# EAGLE schematic example-bjt-circuits (EAGLE 9.6.1)
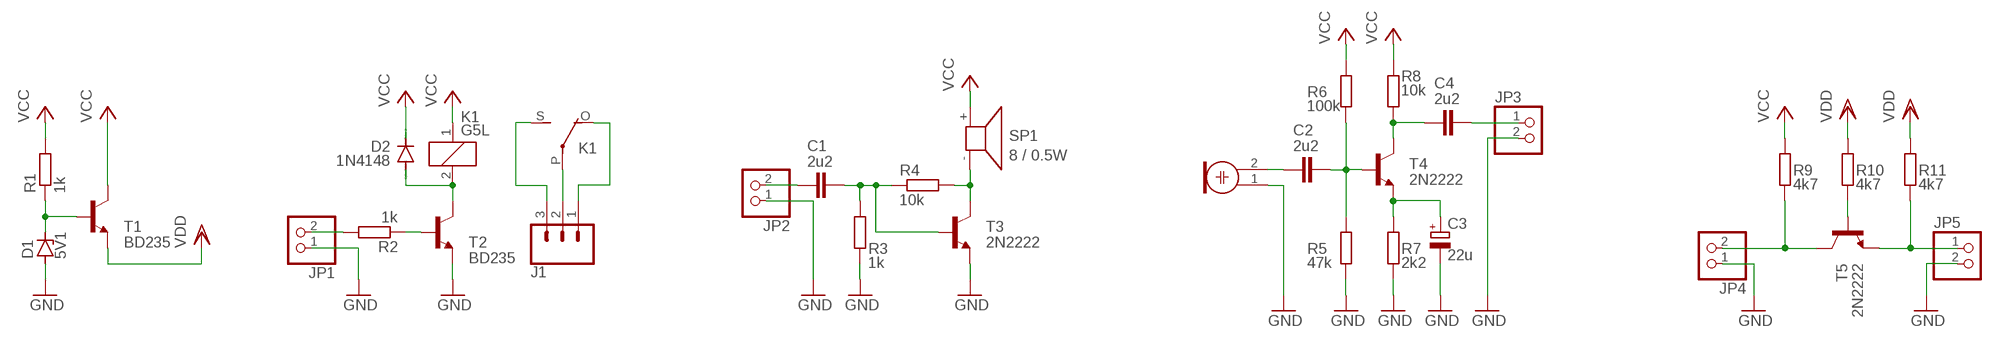
[diagram p0: schematic, sheet 1]

## Parts
C1  2u2  C-EU025-030X050  [C025-030X050]
C2  2u2  C-EU025-030X050  [C025-030X050]
C3  22u  CPOL-EUE2.5-5  [E2,5-5]
C4  2u2  C-EU025-030X050  [C025-030X050]
D1  5V1  ZENER-DIODEC1702-15  [C1702-15]
D2  1N4148  1N4148DO35-10  [DO35-10]
J1  CONN_03SCREW-NS  [SCREWTERMINAL-3.5MM-3-NS]
JP1  PINHD-1X2  [1X02]
JP2  PINHD-1X2  [1X02]
JP3  PINHD-1X2  [1X02]
JP4  PINHD-1X2  [1X02]
JP5  PINHD-1X2  [1X02]
K1  G5L  [G5LE]
M1  ELECTRET_MICROPHON-WM.64PN  [WM-64PN]
R1  1k  R-EU_0207/10  [0207/10]
R2  1k  R-EU_0207/10  [0207/10]
R3  1k  R-EU_0207/10  [0207/10]
R4  10k  R-EU_0207/10  [0207/10]
R5  47k  R-EU_0207/10  [0207/10]
R6  100k  R-EU_0207/10  [0207/10]
R7  2k2  R-EU_0207/10  [0207/10]
R8  10k  R-EU_0207/10  [0207/10]
R9  4k7  R-EU_0207/10  [0207/10]
R10  4k7  R-EU_0207/10  [0207/10]
R11  4k7  R-EU_0207/10  [0207/10]
SP1  8 / 0.5W  AL11P  [AL11P]
T1  BD235  [TO126]
T2  BD235  [TO126]
T3  2N2222  [TO18]
T4  2N2222  [TO18]
T5  2N2222  [TO18]

## Nets
GND: C3.- D1.A JP1.1 JP2.1 JP3.2 JP4.1 JP5.2 M1.1 R3.2 R5.1 R7.1 T2.1(E) T3.1(E)
N$1: D1.C R1.1 T1.3(B)
N$2: D2.A K1.2 T2.2(C)
N$3: R2.1 T2.3(B)
N$4: JP1.2 R2.2
N$5: J1.3 K1.S(2:S)
N$6: J1.2 K1.P(2:P)
N$7: J1.1 K1.O(2:O)
N$8: R4.2 SP1.- T3.3(C)
N$9: C1.1 JP2.2
N$10: C2.2 R5.2 R6.1 T4.2(B)
N$11: C1.2 R3.1 R4.1 T3.2(B)
N$12: C2.1 M1.2
N$13: C3.+ R7.2 T4.1(E)
N$14: R10.1 T5.2(B)
N$15: C4.1 R8.1 T4.3(C)
N$16: C4.2 JP3.1
N$17: JP4.2 R9.1 T5.3(C)
N$18: JP5.1 R11.1 T5.1(E)
VCC: D2.C K1.1 R1.2 R6.2 R8.2 R9.2 SP1.+ T1.2(C)
VDD: R10.2 R11.2 T1.1(E)

## Library data of the parts
C1 C2 C4 = rcl:C-EU: CAPACITOR, European symbol; SPICEPREFIX: C
C3 = rcl:CPOL-EU: POLARIZED CAPACITOR, European symbol; SPICEPREFIX: C
D1 = diode:ZENER-DIODE: Z-Diode
D2 = diode:1N4148: DIODE high speed (Philips)
J1 = SparkFun-Connectors:CONN_03: Multi connection point. Often used as Generic Header-pin footprint for 0.1 inch spaced/style header connections On any of the 0.1 inch spaced packages, you can populate with these: Break Away Headers - Straight <https://www.sparkfun.com/products/116> (PRT-00116) Break Away Male Headers - Right Angle <https://www.sparkfun.com/products/553> (PRT-00553) Female Headers <https://www.sparkfun.com/products/115> (PRT-00115) Break Away Headers - Machine Pin <https://www.sparkfun.com/products/117> (PRT-00117) Break Away Female Headers - Swiss Machine Pin <https://www.sparkfun.com/products/743> (PRT-00743) Stackable Header - 3 Pin (Female, 0.1") <https://www.sparkfun.com/products/13875> (PRT-13875) For SCREWTERMINALS and SPRING TERMINALS visit here: Screw Terimnals on SparkFun.com <https://www.sparkfun.com/search/results?term=Screw+Terminals> (5mm/3.5mm/2.54mm spacing) This device is also useful as a general connection point to wire up your design to another part of your project. Our various solder wires solder well into these plated through hole pads. Hook-Up Wire - Assortment (Stranded, 22 AWG) <https://www.sparkfun.com/products/11375> (PRT-11375) Hook-Up Wire - Assortment (Solid Core, 22 AWG) <https://www.sparkfun.com/products/11367> (PRT-11367) View the entire wire category on our website here <https://www.sparkfun.com/categories/141> Special notes: Molex polarized connector foot print use with SKU : PRT-08232 with associated crimp pins and housings.
JP1-JP5 = pinhead:PINHD-1X2: PIN HEADER
K1 = relay:G5L: RELAY 1 x switch, 10 A/120 V AC, 8 A/30 V ADC, Omron; OC_FARNELL: unknown; OC_NEWARK: unknown
M1 = microphon:ELECTRET_MICROPHON-: Electret Condenser Microphone
R1-R11 = rcl:R-EU_: RESISTOR, European symbol; SPICEPREFIX: R
SP1 = buzzer:AL11P: SPEAKER Source: Buerklin; OC_FARNELL: unknown; OC_NEWARK: unknown
T1 T2 = transistor:BD235: NPN TRANSISTOR
T3-T5 = transistor:2N2222: NPN TRANSISTOR